# Altium schematic sheet STM32_microcontroller_IOs.SchDoc: STM32_microcontroller_IOs
size A3; Date: Not used; ApprovedBy: Not used; CheckedBy: Not used; Author: Not used; CompanyName: STMicroelectronics; DrawnBy: Not used; Engineer: Not used; Organization: Not used; Address1: Not used; Address2: Not used; Address3: Not used; Address4: Not used; DocumentNumber: Not used; Revision: Not used; SheetNumber: 3; SheetTotal: 22; CurrentTime: Not used; CurrentDate: Not used; Time: Not used; DocumentFullPathAndName: Not used; DocumentName: Not used; ModifiedDate: Not used; ImagePath: Not used; ProjectName: Not used; Application_BuildNumber: Not used
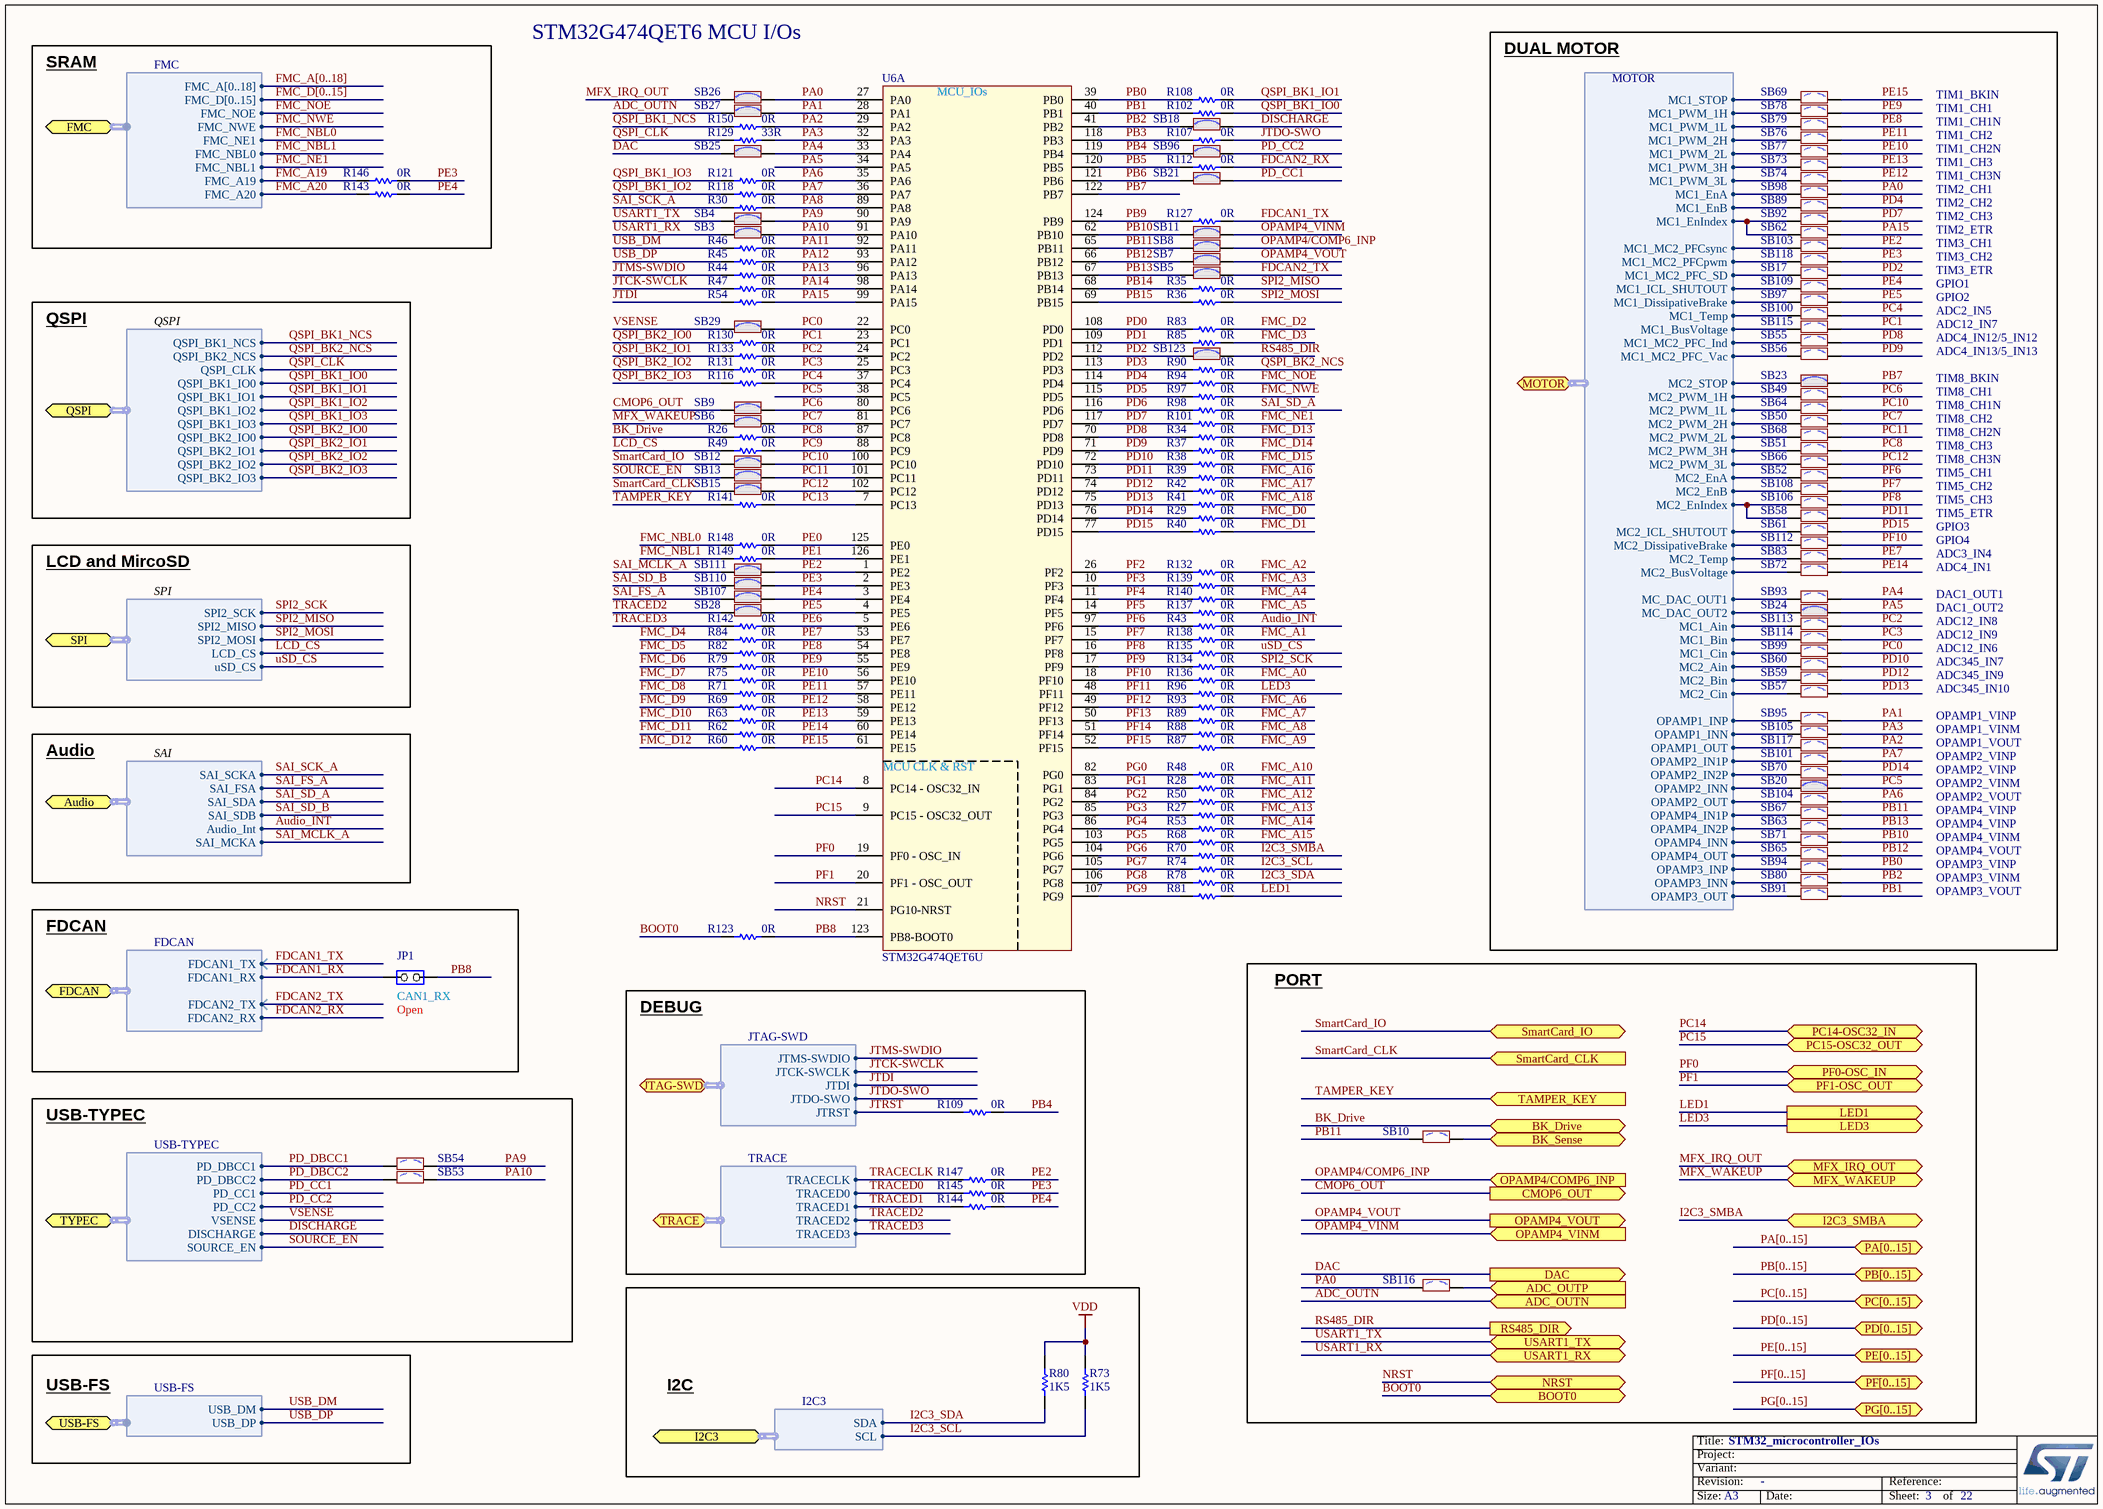
[diagram p0: STM32_microcontroller_IOs.SchDoc]

## Parts
JP1  Jumper_Header 2x1  [CON_SAMTEC_TSW-102-07-G-S]  (value not drawn)
R26  value 0R  [R0402]  (hidden comment: Resistor)
R27  value 0R  [R0402]  (hidden comment: Resistor)
R28  value 0R  [R0402]  (hidden comment: Resistor)
R29  value 0R  [R0402]  (hidden comment: Resistor)
R30  value 0R  [R0402]  (hidden comment: Resistor)
R34  value 0R  [R0402]  (hidden comment: Resistor)
R35  value 0R  [R0402]  (hidden comment: Resistor)
R36  value 0R  [R0402]  (hidden comment: Resistor)
R37  value 0R  [R0402]  (hidden comment: Resistor)
R38  value 0R  [R0402]  (hidden comment: Resistor)
R39  value 0R  [R0402]  (hidden comment: Resistor)
R40  value 0R  [R0402]  (hidden comment: Resistor)
R41  value 0R  [R0402]  (hidden comment: Resistor)
R42  value 0R  [R0402]  (hidden comment: Resistor)
R43  value 0R  [R0402]  (hidden comment: Resistor)
R44  value 0R  [R0402]  (hidden comment: Resistor)
R45  value 0R  [R0402]  (hidden comment: Resistor)
R46  value 0R  [R0402]  (hidden comment: Resistor)
R47  value 0R  [R0402]  (hidden comment: Resistor)
R48  value 0R  [R0402]  (hidden comment: Resistor)
R49  value 0R  [R0402]  (hidden comment: Resistor)
R50  value 0R  [R0402]  (hidden comment: Resistor)
R53  value 0R  [R0402]  (hidden comment: Resistor)
R54  value 0R  [R0402]  (hidden comment: Resistor)
R60  value 0R  [R0402]  (hidden comment: Resistor)
R62  value 0R  [R0402]  (hidden comment: Resistor)
R63  value 0R  [R0402]  (hidden comment: Resistor)
R68  value 0R  [R0402]  (hidden comment: Resistor)
R69  value 0R  [R0402]  (hidden comment: Resistor)
R70  value 0R  [R0402]  (hidden comment: Resistor)
R71  value 0R  [R0402]  (hidden comment: Resistor)
R73  value 1K5  [R0603]  (hidden comment: Resistor)
R74  value 0R  [R0402]  (hidden comment: Resistor)
R75  value 0R  [R0402]  (hidden comment: Resistor)
R78  value 0R  [R0402]  (hidden comment: Resistor)
R79  value 0R  [R0402]  (hidden comment: Resistor)
R80  value 1K5  [R0603]  (hidden comment: Resistor)
R81  value 0R  [R0402]  (hidden comment: Resistor)
R82  value 0R  [R0402]  (hidden comment: Resistor)
R83  value 0R  [R0402]  (hidden comment: Resistor)
R84  value 0R  [R0402]  (hidden comment: Resistor)
R85  value 0R  [R0402]  (hidden comment: Resistor)
R87  value 0R  [R0402]  (hidden comment: Resistor)
R88  value 0R  [R0402]  (hidden comment: Resistor)
R89  value 0R  [R0402]  (hidden comment: Resistor)
R90  value 0R  [R0402]  (hidden comment: Resistor)
R93  value 0R  [R0402]  (hidden comment: Resistor)
R94  value 0R  [R0402]  (hidden comment: Resistor)
R96  value 0R  [R0402]  (hidden comment: Resistor)
R97  value 0R  [R0402]  (hidden comment: Resistor)
R98  value 0R  [R0402]  (hidden comment: Resistor)
R101  value 0R  [R0402]  (hidden comment: Resistor)
R102  value 0R  [R0402]  (hidden comment: Resistor)
R107  value 0R  [R0402]  (hidden comment: Resistor)
R108  value 0R  [R0402]  (hidden comment: Resistor)
R109  value 0R  [R0402]  (hidden comment: Resistor)
R112  value 0R  [R0402]  (hidden comment: Resistor)
R116  value 0R  [R0402]  (hidden comment: Resistor)
R118  value 0R  [R0402]  (hidden comment: Resistor)
R121  value 0R  [R0402]  (hidden comment: Resistor)
R123  value 0R  [R0402]  (hidden comment: Resistor)
R127  value 0R  [R0402]  (hidden comment: Resistor)
R129  value 33R  [R0402]  (hidden comment: Resistor)
R130  value 0R  [R0402]  (hidden comment: Resistor)
R131  value 0R  [R0402]  (hidden comment: Resistor)
R132  value 0R  [R0402]  (hidden comment: Resistor)
R133  value 0R  [R0402]  (hidden comment: Resistor)
R134  value 0R  [R0402]  (hidden comment: Resistor)
R135  value 0R  [R0402]  (hidden comment: Resistor)
R136  value 0R  [R0402]  (hidden comment: Resistor)
R137  value 0R  [R0402]  (hidden comment: Resistor)
R138  value 0R  [R0402]  (hidden comment: Resistor)
R139  value 0R  [R0402]  (hidden comment: Resistor)
R140  value 0R  [R0402]  (hidden comment: Resistor)
R141  value 0R  [R0402]  (hidden comment: Resistor)
R142  value 0R  [R0402]  (hidden comment: Resistor)
R143  value 0R  [R0402]  (hidden comment: Resistor)
R144  value 0R  [R0402]  (hidden comment: Resistor)
R145  value 0R  [R0402]  (hidden comment: Resistor)
R146  value 0R  [R0402]  (hidden comment: Resistor)
R147  value 0R  [R0402]  (hidden comment: Resistor)
R148  value 0R  [R0402]  (hidden comment: Resistor)
R149  value 0R  [R0402]  (hidden comment: Resistor)
R150  value 0R  [R0402]  (hidden comment: Resistor)
SB3  SB_ON  [SOLDER-BRIDGE_R0603-0R]  (value not drawn)
SB4  SB_ON  [SOLDER-BRIDGE_R0603-0R]  (value not drawn)
SB5  SB_ON  [SOLDER-BRIDGE_R0603-0R]  (value not drawn)
SB6  SB_ON  [SOLDER-BRIDGE_R0603-0R]  (value not drawn)
SB7  SB_ON  [SOLDER-BRIDGE_R0603-0R]  (value not drawn)
SB8  SB_ON  [SOLDER-BRIDGE_R0603-0R]  (value not drawn)
SB9  SB_ON  [SOLDER-BRIDGE_R0603-0R]  (value not drawn)
SB10  SB_OFF  [SOLDER-BRIDGE_R0603-0R]  (value not drawn)
SB11  SB_ON  [SOLDER-BRIDGE_R0603-0R]  (value not drawn)
SB12  SB_ON  [SOLDER-BRIDGE_R0603-0R]  (value not drawn)
SB13  SB_ON  [SOLDER-BRIDGE_R0603-0R]  (value not drawn)
SB15  SB_ON  [SOLDER-BRIDGE_R0603-0R]  (value not drawn)
SB17  SB_OFF  [SOLDER-BRIDGE_R0603-0R]  (value not drawn)
SB18  SB_ON  [SOLDER-BRIDGE_R0603-0R]  (value not drawn)
SB20  SB_ON  [SOLDER-BRIDGE_R0603-0R]  (value not drawn)
SB21  SB_ON  [SOLDER-BRIDGE_R0603-0R]  (value not drawn)
SB23  SB_ON  [SOLDER-BRIDGE_R0603-0R]  (value not drawn)
SB24  SB_ON  [SOLDER-BRIDGE_R0603-0R]  (value not drawn)
SB25  SB_ON  [SOLDER-BRIDGE_R0603-0R]  (value not drawn)
SB26  SB_ON  [SOLDER-BRIDGE_R0603-0R]  (value not drawn)
SB27  SB_ON  [SOLDER-BRIDGE_R0603-0R]  (value not drawn)
SB28  SB_ON  [SOLDER-BRIDGE_R0603-0R]  (value not drawn)
SB29  SB_ON  [SOLDER-BRIDGE_R0603-0R]  (value not drawn)
SB49  SB_OFF  [SOLDER-BRIDGE_R0603-0R]  (value not drawn)
SB50  SB_OFF  [SOLDER-BRIDGE_R0603-0R]  (value not drawn)
SB51  SB_OFF  [SOLDER-BRIDGE_R0603-0R]  (value not drawn)
SB52  SB_OFF  [SOLDER-BRIDGE_R0603-0R]  (value not drawn)
SB53  SB_OFF  [SOLDER-BRIDGE_R0603-0R]  (value not drawn)
SB54  SB_OFF  [SOLDER-BRIDGE_R0603-0R]  (value not drawn)
SB55  SB_OFF  [SOLDER-BRIDGE_R0603-0R]  (value not drawn)
SB56  SB_OFF  [SOLDER-BRIDGE_R0603-0R]  (value not drawn)
SB57  SB_OFF  [SOLDER-BRIDGE_R0603-0R]  (value not drawn)
SB58  SB_OFF  [SOLDER-BRIDGE_R0603-0R]  (value not drawn)
SB59  SB_OFF  [SOLDER-BRIDGE_R0603-0R]  (value not drawn)
SB60  SB_OFF  [SOLDER-BRIDGE_R0603-0R]  (value not drawn)
SB61  SB_OFF  [SOLDER-BRIDGE_R0603-0R]  (value not drawn)
SB62  SB_OFF  [SOLDER-BRIDGE_R0603-0R]  (value not drawn)
SB63  SB_OFF  [SOLDER-BRIDGE_R0603-0R]  (value not drawn)
SB64  SB_OFF  [SOLDER-BRIDGE_R0603-0R]  (value not drawn)
SB65  SB_OFF  [SOLDER-BRIDGE_R0603-0R]  (value not drawn)
SB66  SB_OFF  [SOLDER-BRIDGE_R0603-0R]  (value not drawn)
SB67  SB_OFF  [SOLDER-BRIDGE_R0603-0R]  (value not drawn)
SB68  SB_OFF  [SOLDER-BRIDGE_R0603-0R]  (value not drawn)
SB69  SB_OFF  [SOLDER-BRIDGE_R0603-0R]  (value not drawn)
SB70  SB_OFF  [SOLDER-BRIDGE_R0603-0R]  (value not drawn)
SB71  SB_OFF  [SOLDER-BRIDGE_R0603-0R]  (value not drawn)
SB72  SB_OFF  [SOLDER-BRIDGE_R0603-0R]  (value not drawn)
SB73  SB_OFF  [SOLDER-BRIDGE_R0603-0R]  (value not drawn)
SB74  SB_OFF  [SOLDER-BRIDGE_R0603-0R]  (value not drawn)
SB76  SB_OFF  [SOLDER-BRIDGE_R0603-0R]  (value not drawn)
SB77  SB_OFF  [SOLDER-BRIDGE_R0603-0R]  (value not drawn)
SB78  SB_OFF  [SOLDER-BRIDGE_R0603-0R]  (value not drawn)
SB79  SB_OFF  [SOLDER-BRIDGE_R0603-0R]  (value not drawn)
SB80  SB_OFF  [SOLDER-BRIDGE_R0603-0R]  (value not drawn)
SB83  SB_OFF  [SOLDER-BRIDGE_R0603-0R]  (value not drawn)
SB89  SB_OFF  [SOLDER-BRIDGE_R0603-0R]  (value not drawn)
SB91  SB_OFF  [SOLDER-BRIDGE_R0603-0R]  (value not drawn)
SB92  SB_OFF  [SOLDER-BRIDGE_R0603-0R]  (value not drawn)
SB93  SB_OFF  [SOLDER-BRIDGE_R0603-0R]  (value not drawn)
SB94  SB_OFF  [SOLDER-BRIDGE_R0603-0R]  (value not drawn)
SB95  SB_OFF  [SOLDER-BRIDGE_R0603-0R]  (value not drawn)
SB96  SB_ON  [SOLDER-BRIDGE_R0603-0R]  (value not drawn)
SB97  SB_OFF  [SOLDER-BRIDGE_R0603-0R]  (value not drawn)
SB98  SB_OFF  [SOLDER-BRIDGE_R0603-0R]  (value not drawn)
SB99  SB_OFF  [SOLDER-BRIDGE_R0603-0R]  (value not drawn)
SB100  SB_OFF  [SOLDER-BRIDGE_R0603-0R]  (value not drawn)
SB101  SB_OFF  [SOLDER-BRIDGE_R0603-0R]  (value not drawn)
SB103  SB_OFF  [SOLDER-BRIDGE_R0603-0R]  (value not drawn)
SB104  SB_OFF  [SOLDER-BRIDGE_R0603-0R]  (value not drawn)
SB105  SB_OFF  [SOLDER-BRIDGE_R0603-0R]  (value not drawn)
SB106  SB_OFF  [SOLDER-BRIDGE_R0603-0R]  (value not drawn)
SB107  SB_ON  [SOLDER-BRIDGE_R0603-0R]  (value not drawn)
SB108  SB_OFF  [SOLDER-BRIDGE_R0603-0R]  (value not drawn)
SB109  SB_OFF  [SOLDER-BRIDGE_R0603-0R]  (value not drawn)
SB110  SB_ON  [SOLDER-BRIDGE_R0603-0R]  (value not drawn)
SB111  SB_ON  [SOLDER-BRIDGE_R0603-0R]  (value not drawn)
SB112  SB_OFF  [SOLDER-BRIDGE_R0603-0R]  (value not drawn)
SB113  SB_OFF  [SOLDER-BRIDGE_R0603-0R]  (value not drawn)
SB114  SB_OFF  [SOLDER-BRIDGE_R0603-0R]  (value not drawn)
SB115  SB_OFF  [SOLDER-BRIDGE_R0603-0R]  (value not drawn)
SB116  SB_OFF  [SOLDER-BRIDGE_R0603-0R]  (value not drawn)
SB117  SB_OFF  [SOLDER-BRIDGE_R0603-0R]  (value not drawn)
SB118  SB_OFF  [SOLDER-BRIDGE_R0603-0R]  (value not drawn)
SB123  SB_ON  [SOLDER-BRIDGE_R0603-0R]  (value not drawn)
U6  STM32G474QET6U  [ICC_LQFP128_14X14_P040]  (part A of 2)

## Blocks framed on the sheet
SRAM: R143 R146
DUAL MOTOR: SB17 SB20 SB23 SB24 SB49-SB52 SB55-SB74 SB76-SB80 SB83 SB89 SB91-SB95 SB97-SB101 SB103-SB106 SB108 SB109 SB112-SB115 SB117 SB118
FDCAN: JP1
DEBUG: R109 R144 R145 R147
PORT: SB10 SB116
USB-TYPEC: SB53 SB54
I2C: R73 R80

## Ports
ADC_OUTN (in), ADC_OUTP (in), Audio (harness SAI), BK_Drive, BK_Sense, BOOT0, CMOP6_OUT (out), DAC (out), FDCAN (harness FDCAN), FMC (harness FMC), I2C3 (harness I2C3), I2C3_SMBA, JTAG-SWD (harness JTAG-SWD), LED1 (out), LED3 (out), MFX_IRQ_OUT, MFX_WAKEUP, MOTOR (harness MOTOR), NRST, OPAMP4/COMP6_INP (in), OPAMP4_VINM (in), OPAMP4_VOUT (out), PA[0..15], PB[0..15], PC14-OSC32_IN, PC15-OSC32_OUT, PC[0..15], PD[0..15], PE[0..15], PF0-OSC_IN, PF1-OSC_OUT, PF[0..15], PG[0..15], QSPI (harness QSPI), RS485_DIR (out), SmartCard_CLK (in), SmartCard_IO (bidir), SPI (harness SPI), TAMPER_KEY (in), TRACE (harness TRACE), TYPEC (harness USB-TYPEC), USART1_RX, USART1_TX, USB-FS (harness USB-FS)

## Harnesses
FMC: FMC_NWE, FMC_NOE, FMC_NE1, FMC_A[0..18], FMC_D[0..15], FMC_NBL0, FMC_NBL1, FMC_A19, FMC_A20
MOTOR: MC1_PWM_1H, MC1_PWM_1L, MC1_PWM_2H, MC1_PWM_2L, MC1_PWM_3H, MC1_PWM_3L, MC1_STOP, MC1_EnA, MC1_EnB, MC1_EnIndex, MC1_MC2_PFCsync, MC1_MC2_PFCpwm, MC1_MC2_PFC_SD, MC1_ICL_SHUTOUT, MC1_DissipativeBrake, MC1_Temp, MC1_BusVoltage, MC1_MC2_PFC_Ind, MC1_MC2_PFC_Vac, MC2_STOP, MC2_PWM_1H, MC2_PWM_1L, MC2_PWM_2H, MC2_PWM_2L, MC2_PWM_3H, MC2_PWM_3L, MC2_EnA, MC2_EnB, MC2_EnIndex, MC2_ICL_SHUTOUT, MC2_DissipativeBrake, MC2_Temp, MC2_BusVoltage, MC_DAC_OUT1, MC_DAC_OUT2, MC1_Ain, MC1_Bin, MC1_Cin, MC2_Ain, MC2_Bin, MC2_Cin, OPAMP1_INP, OPAMP1_INN, OPAMP1_OUT, OPAMP2_IN1P, OPAMP2_IN2P, OPAMP2_INN, OPAMP2_OUT, OPAMP4_IN1P, OPAMP4_IN2P, OPAMP4_INN, OPAMP4_OUT, OPAMP3_INP, OPAMP3_INN, OPAMP3_OUT
SPI: SPI2_SCK, SPI2_MISO, SPI2_MOSI, LCD_CS, uSD_CS
QSPI: QSPI_BK1_IO1, QSPI_BK1_IO0, QSPI_CLK, QSPI_BK1_NCS, QSPI_BK1_IO2, QSPI_BK1_IO3, QSPI_BK2_IO1, QSPI_BK2_IO0, QSPI_BK2_IO2, QSPI_BK2_IO3, QSPI_BK2_NCS
SAI: SAI_SDB, SAI_FSA, Audio_Int, SAI_SDA, SAI_SCKA, SAI_MCKA
FDCAN: FDCAN1_TX, FDCAN1_RX, FDCAN2_TX, FDCAN2_RX
USB-FS: USB_DM, USB_DP
JTAG-SWD: JTMS-SWDIO, JTCK-SWCLK, JTDI, JTDO-SWO, JTRST
TRACE: TRACECLK, TRACED0, TRACED1, TRACED2, TRACED3
I2C3: SDA, SCL
USB-TYPEC: PD_DBCC1, PD_DBCC2, PD_CC1, PD_CC2, VSENSE, DISCHARGE, SOURCE_EN

## Nets
VDD: R73.2 R80.2
ADC_OUTN: SB27.1 ; port ADC_OUTN
ADC_OUTP: SB116.2 ; port ADC_OUTP
Audio_INT: R43.2 ; port Audio.Audio_Int
BK_Drive: R26.1 ; port BK_Drive
BK_Sense: SB10.2 ; port BK_Sense
BOOT0: R123.1 ; port BOOT0
CMOP6_OUT: SB9.1 ; port CMOP6_OUT
DAC: SB25.1 ; port DAC
DISCHARGE: SB18.2 ; port TYPEC.DISCHARGE
FDCAN1_RX: JP1.2(NO) ; port FDCAN.FDCAN1_RX
FDCAN1_TX: R127.2 ; port FDCAN.FDCAN1_TX
FDCAN2_RX: R112.2 ; port FDCAN.FDCAN2_RX
FDCAN2_TX: SB5.2 ; port FDCAN.FDCAN2_TX
FMC_A0: R136.2
FMC_A1: R138.2
FMC_A2: R132.2
FMC_A3: R139.2
FMC_A4: R140.2
FMC_A5: R137.2
FMC_A6: R93.2
FMC_A7: R89.2
FMC_A8: R88.2
FMC_A9: R87.2
FMC_A10: R48.2
FMC_A11: R28.2
FMC_A12: R50.2
FMC_A13: R27.2
FMC_A14: R53.2
FMC_A15: R68.2
FMC_A16: R39.2
FMC_A17: R42.2
FMC_A18: R41.2
FMC_A19: R146.1 ; port FMC.FMC_A19
FMC_A20: R143.1 ; port FMC.FMC_A20
FMC_D0: R29.2
FMC_D1: R40.2
FMC_D2: R83.2
FMC_D3: R85.2
FMC_D4: R84.1
FMC_D5: R82.1
FMC_D6: R79.1
FMC_D7: R75.1
FMC_D8: R71.1
FMC_D9: R69.1
FMC_D10: R63.1
FMC_D11: R62.1
FMC_D12: R60.1
FMC_D13: R34.2
FMC_D14: R37.2
FMC_D15: R38.2
FMC_NBL0: R148.1 ; port FMC.FMC_NE1
FMC_NBL1: R149.1 ; port FMC.FMC_NBL0
FMC_NE1: R101.2 ; port FMC.FMC_NBL1
FMC_NOE: R94.2 ; port FMC.FMC_NOE
FMC_NWE: R97.2 ; port FMC.FMC_NWE
I2C3_SCL: R73.1 R74.2 ; port I2C3.SCL
I2C3_SDA: R78.2 R80.1 ; port I2C3.SDA
I2C3_SMBA: R70.2 ; port I2C3_SMBA
JTCK-SWCLK: R47.1 ; port JTAG-SWD.JTCK-SWCLK
JTDI: R54.1 ; port JTAG-SWD.JTDI
JTDO-SWO: R107.2 ; port JTAG-SWD.JTDO-SWO
JTMS-SWDIO: R44.1 ; port JTAG-SWD.JTMS-SWDIO
JTRST: R109.1 ; port JTAG-SWD.JTRST
LCD_CS: R49.1 ; port SPI.LCD_CS
LED1: R81.2 ; port LED1
LED3: R96.2 ; port LED3
MFX_IRQ_OUT: SB26.1 ; port MFX_IRQ_OUT
MFX_WAKEUP: SB6.1 ; port MFX_WAKEUP
NRST: U6.21(PG10-NRST) ; port NRST
OPAMP4/COMP6_INP: SB8.2 ; port OPAMP4/COMP6_INP
OPAMP4_VINM: SB11.2 ; port OPAMP4_VINM
OPAMP4_VOUT: SB7.2 ; port OPAMP4_VOUT
PA0: SB26.2 SB98.2 SB116.1 U6.27(PA0)
PA1: SB27.2 SB95.2 U6.28(PA1)
PA2: R150.2 SB117.2 U6.29(PA2)
PA3: R129.2 SB105.2 U6.32(PA3)
PA4: SB25.2 SB93.2 U6.33(PA4)
PA5: SB24.2 U6.34(PA5)
PA6: R121.2 SB104.2 U6.35(PA6)
PA7: R118.2 SB101.2 U6.36(PA7)
PA8: R30.2 U6.89(PA8)
PA9: SB4.2 SB54.2 U6.90(PA9)
PA10: SB3.2 SB53.2 U6.91(PA10)
PA11: R46.2 U6.92(PA11)
PA12: R45.2 U6.93(PA12)
PA13: R44.2 U6.96(PA13)
PA14: R47.2 U6.98(PA14)
PA15: R54.2 SB62.2 U6.99(PA15)
PB0: R108.1 SB94.2 U6.39(PB0)
PB1: R102.1 SB91.2 U6.40(PB1)
PB2: SB18.1 SB80.2 U6.41(PB2)
PB3: R107.1 U6.118(PB3)
PB4: R109.2 SB96.1 U6.119(PB4)
PB5: R112.1 U6.120(PB5)
PB6: SB21.1 U6.121(PB6)
PB7: SB23.2 U6.122(PB7)
PB8: JP1.1(COMMON) R123.2 U6.123(PB8-BOOT0)
PB9: R127.1 U6.124(PB9)
PB10: SB11.1 SB71.2 U6.62(PB10)
PB11: SB8.1 SB10.1 SB67.2 U6.65(PB11)
PB12: SB7.1 SB65.2 U6.66(PB12)
PB13: SB5.1 SB63.2 U6.67(PB13)
PB14: R35.1 U6.68(PB14)
PB15: R36.1 U6.69(PB15)
PC0: SB29.2 SB99.2 U6.22(PC0)
PC1: R130.2 SB115.2 U6.23(PC1)
PC2: R133.2 SB113.2 U6.24(PC2)
PC3: R131.2 SB114.2 U6.25(PC3)
PC4: R116.2 SB100.2 U6.37(PC4)
PC5: SB20.2 U6.38(PC5)
PC6: SB9.2 SB49.2 U6.80(PC6)
PC7: SB6.2 SB50.2 U6.81(PC7)
PC8: R26.2 SB51.2 U6.87(PC8)
PC9: R49.2 U6.88(PC9)
PC10: SB12.2 SB64.2 U6.100(PC10)
PC11: SB13.2 SB68.2 U6.101(PC11)
PC12: SB15.2 SB66.2 U6.102(PC12)
PC13: R141.2 U6.7(PC13)
PC14: U6.8(PC14_-_OSC32_IN) ; port PC14-OSC32_IN
PC15: U6.9(PC15_-_OSC32_OUT) ; port PC15-OSC32_OUT
PD0: R83.1 U6.108(PD0)
PD1: R85.1 U6.109(PD1)
PD2: SB17.2 SB123.1 U6.112(PD2)
PD3: R90.1 U6.113(PD3)
PD4: R94.1 SB89.2 U6.114(PD4)
PD5: R97.1 U6.115(PD5)
PD6: R98.1 U6.116(PD6)
PD7: R101.1 SB92.2 U6.117(PD7)
PD8: R34.1 SB55.2 U6.70(PD8)
PD9: R37.1 SB56.2 U6.71(PD9)
PD10: R38.1 SB60.2 U6.72(PD10)
PD11: R39.1 SB58.2 U6.73(PD11)
PD12: R42.1 SB59.2 U6.74(PD12)
PD13: R41.1 SB57.2 U6.75(PD13)
PD14: R29.1 SB70.2 U6.76(PD14)
PD15: R40.1 SB61.2 U6.77(PD15)
PD_CC1: SB21.2 ; port TYPEC.PD_CC1
PD_CC2: SB96.2 ; port TYPEC.PD_CC2
PD_DBCC1: SB54.1 ; port TYPEC.PD_DBCC1
PD_DBCC2: SB53.1 ; port TYPEC.PD_DBCC2
PE0: R148.2 U6.125(PE0)
PE1: R149.2 U6.126(PE1)
PE2: R147.2 SB103.2 SB111.2 U6.1(PE2)
PE3: R145.2 R146.2 SB110.2 SB118.2 U6.2(PE3)
PE4: R143.2 R144.2 SB107.2 SB109.2 U6.3(PE4)
PE5: SB28.2 SB97.2 U6.4(PE5)
PE6: R142.2 U6.5(PE6)
PE7: R84.2 SB83.2 U6.53(PE7)
PE8: R82.2 SB79.2 U6.54(PE8)
PE9: R79.2 SB78.2 U6.55(PE9)
PE10: R75.2 SB77.2 U6.56(PE10)
PE11: R71.2 SB76.2 U6.57(PE11)
PE12: R69.2 SB74.2 U6.58(PE12)
PE13: R63.2 SB73.2 U6.59(PE13)
PE14: R62.2 SB72.2 U6.60(PE14)
PE15: R60.2 SB69.2 U6.61(PE15)
PF0: U6.19(PF0_-_OSC_IN) ; port PF0-OSC_IN
PF1: U6.20(PF1_-_OSC_OUT) ; port PF1-OSC_OUT
PF2: R132.1 U6.26(PF2)
PF3: R139.1 U6.10(PF3)
PF4: R140.1 U6.11(PF4)
PF5: R137.1 U6.14(PF5)
PF6: R43.1 SB52.2 U6.97(PF6)
PF7: R138.1 SB108.2 U6.15(PF7)
PF8: R135.1 SB106.2 U6.16(PF8)
PF9: R134.1 U6.17(PF9)
PF10: R136.1 SB112.2 U6.18(PF10)
PF11: R96.1 U6.48(PF11)
PF12: R93.1 U6.49(PF12)
PF13: R89.1 U6.50(PF13)
PF14: R88.1 U6.51(PF14)
PF15: R87.1 U6.52(PF15)
PG0: R48.1 U6.82(PG0)
PG1: R28.1 U6.83(PG1)
PG2: R50.1 U6.84(PG2)
PG3: R27.1 U6.85(PG3)
PG4: R53.1 U6.86(PG4)
PG5: R68.1 U6.103(PG5)
PG6: R70.1 U6.104(PG6)
PG7: R74.1 U6.105(PG7)
PG8: R78.1 U6.106(PG8)
PG9: R81.1 U6.107(PG9)
QSPI_BK1_IO0: R102.2 ; port QSPI.QSPI_BK1_IO0
QSPI_BK1_IO1: R108.2 ; port QSPI.QSPI_BK1_IO1
QSPI_BK1_IO2: R118.1 ; port QSPI.QSPI_BK1_IO2
QSPI_BK1_IO3: R121.1 ; port QSPI.QSPI_BK1_IO3
QSPI_BK1_NCS: R150.1 ; port QSPI.QSPI_BK1_NCS
QSPI_BK2_IO0: R130.1 ; port QSPI.QSPI_BK2_IO0
QSPI_BK2_IO1: R133.1 ; port QSPI.QSPI_BK2_IO1
QSPI_BK2_IO2: R131.1 ; port QSPI.QSPI_BK2_IO2
QSPI_BK2_IO3: R116.1 ; port QSPI.QSPI_BK2_IO3
QSPI_BK2_NCS: R90.2 ; port QSPI.QSPI_BK2_NCS
QSPI_CLK: R129.1 ; port QSPI.QSPI_CLK
RS485_DIR: SB123.2 ; port RS485_DIR
SAI_FS_A: SB107.1 ; port Audio.SAI_FSA
SAI_MCLK_A: SB111.1 ; port Audio.SAI_MCKA
SAI_SCK_A: R30.1 ; port Audio.SAI_SCKA
SAI_SD_A: R98.2 ; port Audio.SAI_SDA
SAI_SD_B: SB110.1 ; port Audio.SAI_SDB
SmartCard_CLK: SB15.1 ; port SmartCard_CLK
SmartCard_IO: SB12.1 ; port SmartCard_IO
SOURCE_EN: SB13.1 ; port TYPEC.SOURCE_EN
SPI2_MISO: R35.2 ; port SPI.SPI2_MISO
SPI2_MOSI: R36.2 ; port SPI.SPI2_MOSI
SPI2_SCK: R134.2 ; port SPI.SPI2_SCK
TAMPER_KEY: R141.1 ; port TAMPER_KEY
TRACECLK: R147.1 ; port TRACE.TRACECLK
TRACED0: R145.1 ; port TRACE.TRACED0
TRACED1: R144.1 ; port TRACE.TRACED1
TRACED2: SB28.1 ; port TRACE.TRACED2
TRACED3: R142.1 ; port TRACE.TRACED3
USART1_RX: SB3.1 ; port USART1_RX
USART1_TX: SB4.1 ; port USART1_TX
USB_DM: R46.1 ; port USB-FS.USB_DM
USB_DP: R45.1 ; port USB-FS.USB_DP
uSD_CS: R135.2 ; port SPI.uSD_CS
VSENSE: SB29.1 ; port TYPEC.VSENSE
NetSB17_1: SB17.1 ; port MOTOR.MC1_MC2_PFC_SD
NetSB20_1: SB20.1 ; port MOTOR.OPAMP2_INN
NetSB23_1: SB23.1 ; port MOTOR.MC2_STOP
NetSB24_1: SB24.1 ; port MOTOR.MC_DAC_OUT2
NetSB49_1: SB49.1 ; port MOTOR.MC2_PWM_1H
NetSB50_1: SB50.1 ; port MOTOR.MC2_PWM_2H
NetSB51_1: SB51.1 ; port MOTOR.MC2_PWM_3H
NetSB52_1: SB52.1 ; port MOTOR.MC2_EnA
NetSB55_1: SB55.1 ; port MOTOR.MC1_MC2_PFC_Ind
NetSB56_1: SB56.1 ; port MOTOR.MC1_MC2_PFC_Vac
NetSB57_1: SB57.1 ; port MOTOR.MC2_Cin
NetSB58_1: SB58.1 SB106.1 ; port MOTOR.MC2_EnIndex
NetSB59_1: SB59.1 ; port MOTOR.MC2_Bin
NetSB60_1: SB60.1 ; port MOTOR.MC2_Ain
NetSB61_1: SB61.1 ; port MOTOR.MC2_ICL_SHUTOUT
NetSB62_1: SB62.1 SB92.1 ; port MOTOR.MC1_EnIndex
NetSB63_1: SB63.1 ; port MOTOR.OPAMP4_IN2P
NetSB64_1: SB64.1 ; port MOTOR.MC2_PWM_1L
NetSB65_1: SB65.1 ; port MOTOR.OPAMP4_OUT
NetSB66_1: SB66.1 ; port MOTOR.MC2_PWM_3L
NetSB67_1: SB67.1 ; port MOTOR.OPAMP4_IN1P
NetSB68_1: SB68.1 ; port MOTOR.MC2_PWM_2L
NetSB69_1: SB69.1 ; port MOTOR.MC1_STOP
NetSB70_1: SB70.1 ; port MOTOR.OPAMP2_IN2P
NetSB71_1: SB71.1 ; port MOTOR.OPAMP4_INN
NetSB72_1: SB72.1 ; port MOTOR.MC2_BusVoltage
NetSB73_1: SB73.1 ; port MOTOR.MC1_PWM_3H
NetSB74_1: SB74.1 ; port MOTOR.MC1_PWM_3L
NetSB76_1: SB76.1 ; port MOTOR.MC1_PWM_2H
NetSB77_1: SB77.1 ; port MOTOR.MC1_PWM_2L
NetSB78_1: SB78.1 ; port MOTOR.MC1_PWM_1H
NetSB79_1: SB79.1 ; port MOTOR.MC1_PWM_1L
NetSB80_1: SB80.1 ; port MOTOR.OPAMP3_INN
NetSB83_1: SB83.1 ; port MOTOR.MC2_Temp
NetSB89_1: SB89.1 ; port MOTOR.MC1_EnB
NetSB91_1: SB91.1 ; port MOTOR.OPAMP3_OUT
NetSB93_1: SB93.1 ; port MOTOR.MC_DAC_OUT1
NetSB94_1: SB94.1 ; port MOTOR.OPAMP3_INP
NetSB95_1: SB95.1 ; port MOTOR.OPAMP1_INP
NetSB97_1: SB97.1 ; port MOTOR.MC1_DissipativeBrake
NetSB98_1: SB98.1 ; port MOTOR.MC1_EnA
NetSB99_1: SB99.1 ; port MOTOR.MC1_Cin
NetSB100_1: SB100.1 ; port MOTOR.MC1_Temp
NetSB101_1: SB101.1 ; port MOTOR.OPAMP2_IN1P
NetSB103_1: SB103.1 ; port MOTOR.MC1_MC2_PFCsync
NetSB104_1: SB104.1 ; port MOTOR.OPAMP2_OUT
NetSB105_1: SB105.1 ; port MOTOR.OPAMP1_INN
NetSB108_1: SB108.1 ; port MOTOR.MC2_EnB
NetSB109_1: SB109.1 ; port MOTOR.MC1_ICL_SHUTOUT
NetSB112_1: SB112.1 ; port MOTOR.MC2_DissipativeBrake
NetSB113_1: SB113.1 ; port MOTOR.MC1_Ain
NetSB114_1: SB114.1 ; port MOTOR.MC1_Bin
NetSB115_1: SB115.1 ; port MOTOR.MC1_BusVoltage
NetSB117_1: SB117.1 ; port MOTOR.OPAMP1_OUT
NetSB118_1: SB118.1 ; port MOTOR.MC1_MC2_PFCpwm

## Buses and harness runs
bus FMC_A[0..18]
bus FMC_D[0..15]
bus PA[0..15] = port PA[0..15]
bus PB[0..15] = port PB[0..15]
bus PC[0..15] = port PC[0..15]
bus PD[0..15] = port PD[0..15]
bus PE[0..15] = port PE[0..15]
bus PF[0..15] = port PF[0..15]
bus PG[0..15] = port PG[0..15]

## Notes on the sheet
- STM32G474QET6 MCU I/Os
- QSPI
- LCD and MircoSD
- Audio
- TIM1_BKIN
  TIM1_CH1
  TIM1_CH1N
  TIM1_CH2
  TIM1_CH2N
  TIM1_CH3
  TIM1_CH3N
  TIM2_CH1
  TIM2_CH2
  TIM2_CH3
  TIM2_ETR
  TIM3_CH1
  TIM3_CH2
  TIM3_ETR
  GPIO1
  GPIO2
  ADC2_IN5
  ADC12_IN7
  ADC4_IN12/5_IN12
  ADC4_IN13/5_IN13
  TIM8_BKIN
  TIM8_CH1
  TIM8_CH1N
  TIM8_CH2
  TIM8_CH2N
  TIM8_CH3
  TIM8_CH3N
  TIM5_CH1
  TIM5_CH2
  TIM5_CH3
  TIM5_ETR
  GPIO3
  GPIO4
  ADC3_IN4
  ADC4_IN1
  DAC1_OUT1
  DAC1_OUT2
  ADC12_IN8
  ADC12_IN9
  ADC12_IN6
  ADC345_IN7
  ADC345_IN9
  ADC345_IN10
  OPAMP1_VINP
  OPAMP1_VINM
  OPAMP1_VOUT
  OPAMP2_VINP
  OPAMP2_VINP
  OPAMP2_VINM
  OPAMP2_VOUT
  OPAMP4_VINP
  OPAMP4_VINP
  OPAMP4_VINM
  OPAMP4_VOUT
  OPAMP3_VINP
  OPAMP3_VINM
  OPAMP3_VOUT
- (near JP1) Open
- (near JP1) CAN1_RX
- USB-FS
- Title:
- Project:
- Size:
- Revision:
- Variant:
- A3
- -
- Date:
- Reference:
- Sheet:
- of
- (in symbol MCD-01707, part A) MCU_IOs; MCU CLK & RST

## Library data of the parts
JP1 = MCD-00045: Header, 2x1, 2,54mm, VR, TH, Height 5.84mm/2.54mm; Manufacturer_Part_Number: TSW-102-07-x-S; Manufacturer: SAMTEC; Part_Type: Connector; Value: Shunt not fitted; Provided_By: SUBCO; Initial_Board_Reference: MB1274; Path: ws/MCD_ApplicationBoards/Lists/MCDPARTSdatabase; Item Type: Item; Internal_Part_Number: MCD-00045; ComponentLink1Description: Datasheet; Status: Released; ComponentLink1URL: http://tunmcdsvn.tun.st.com/Component_Datasheet_Library/Trunk/Connectors/Samtec_TSW-HTSW-series
R26 R30 R35 R36 R43-R47 R49 R54 R70 R74 R78 R81 R94 R96-R98 R101 R107 R109 R112 R123 R127 R134 R135 R141 R142 R144 R145 R147-R149 = MCD-00052: Resistor,0R,0402,5%,1/16W; Manufacturer_Part_Number: RC0402JR-070RL; Manufacturer: YAGEO; Provided_By: SUBCO; Initial_Board_Reference: MB1274; Path: ws/MCD_ApplicationBoards/Lists/MCDPARTSdatabase; Item Type: Item; Internal_Part_Number: MCD-00052; Status: Released; Part_Type: Resistor; Package: R0402; ComponentLink1Description: Datasheet; ComponentLink1URL: http://tunmcdsvn.tun.st.com/Component_Datasheet_Library/Trunk/Resistors/Yageo_Resistor_RC0402-series
R27-R29 R34 R37-R42 R48 R50 R53 R60 R62 R63 R68 R69 R71 R75 R79 R82-R85 R87-R90 R93 R102 R108 R116 R118 R121 R130-R133 R136-R140 R143 R146 R150 = MCD-00052: Resistor,0R,0402,5%,1/16W; Internal_Part_Number: MCD-00052
R73 R80 = MCD-00217: Resistor,1K5,0603,1%,1/10W; Manufacturer_Part_Number: RC0603FR-071K5L; Manufacturer: YAGEO; BMS_Part_Number: 9129766; Provided_By: SUBCO; Initial_Board_Reference: MB1319; Path: ws/MCD_ApplicationBoards/Lists/MCDPARTSdatabase; Item Type: Item; Internal_Part_Number: MCD-00217; Status: Released; Part_Type: Resistor; Package: R0603; ComponentLink1Description: Datasheet; ComponentLink1URL: http://tunmcdsvn.tun.st.com/Component_Datasheet_Library/Trunk/Resistors/Yageo_Resistor_RC0603-series
R129 = MCD-00455: Resistor,33R,0402,1%,1/16W; Manufacturer_Part_Number: RC0402FR-0733RL; Manufacturer: YAGEO; Provided_By: SUBCO; Initial_Board_Reference: MBxxxx; Path: ws/MCD_ApplicationBoards/Lists/MCDPARTSdatabase; Item Type: Item; Internal_Part_Number: MCD-00455; Status: Released; Part_Type: Resistor; Package: R0402; ComponentLink1Description: Datasheet; ComponentLink1URL: http://tunmcdsvn.tun.st.com/Component_Datasheet_Library/Trunk/Resistors/Yageo_Resistor_RC0402-series
SB3-SB9 SB11-SB13 SB15 SB18 SB20 SB21 SB23-SB29 SB96 SB107 SB110 SB111 SB123 = MCD-00071: Solder Bridge ON; Part_Type: Mechanical; Manufacturer_Part_Number: RC0603JR-070RL; Manufacturer: YAGEO; Provided_By: SUBCO; Initial_Board_Reference: MB1274; Path: ws/MCD_ApplicationBoards/Lists/MCDPARTSdatabase; Item Type: Item; Internal_Part_Number: MCD-00071; Status: Released; ComponentLink1Description: Datasheet; Package: SB0603; ComponentLink1URL: http://tunmcdsvn.tun.st.com/Component_Datasheet_Library/Trunk/Resistors/Yageo_Resistor_RC0603-series
SB10 SB17 SB49-SB74 SB76-SB80 SB83 SB89 SB91-SB95 SB97-SB101 SB103-SB106 SB108 SB109 SB112-SB118 = MCD-00072: Solder Bridge OFF; Part_Type: Mechanical; Manufacturer_Part_Number: RC0603JR-070RL; Manufacturer: YAGEO; Provided_By: SUBCO; Initial_Board_Reference: MB1274; Path: ws/MCD_ApplicationBoards/Lists/MCDPARTSdatabase; Item Type: Item; Internal_Part_Number: MCD-00072; Status: Released; ComponentLink1Description: Datasheet; Package: SB0603; ComponentLink1URL: http://tunmcdsvn.tun.st.com/Component_Datasheet_Library/Trunk/Resistors/Yageo_Resistor_RC0603-series
U6 = MCD-01707: ARM® Cortex®-M4 32-bit MCU, 512 KB Flash, 96 KB RAM, 5x USART, timers, ADC, DAC, comm. I/F, 1.65-3.6V; Part_Type: IC; Manufacturer: STMICROELECTRONICS; Provided_By: SUBCO with ST control; Internal_Part_Number: MCD-01707; Value: STM32G474QET6U; Status: Released; Manufacturer_Part_Number: STM32G474QET6U; Package: LQFP128; ComponentLink1Description: Datasheet; ComponentLink1URL: http://tunmcdsvn.tun.st.com/Component_Datasheet_Library/Trunk/IC/STM_MCU_STM32G474WET6